# EAGLE design AQ_sensor_SIGFOX (EAGLE 9.6.2)
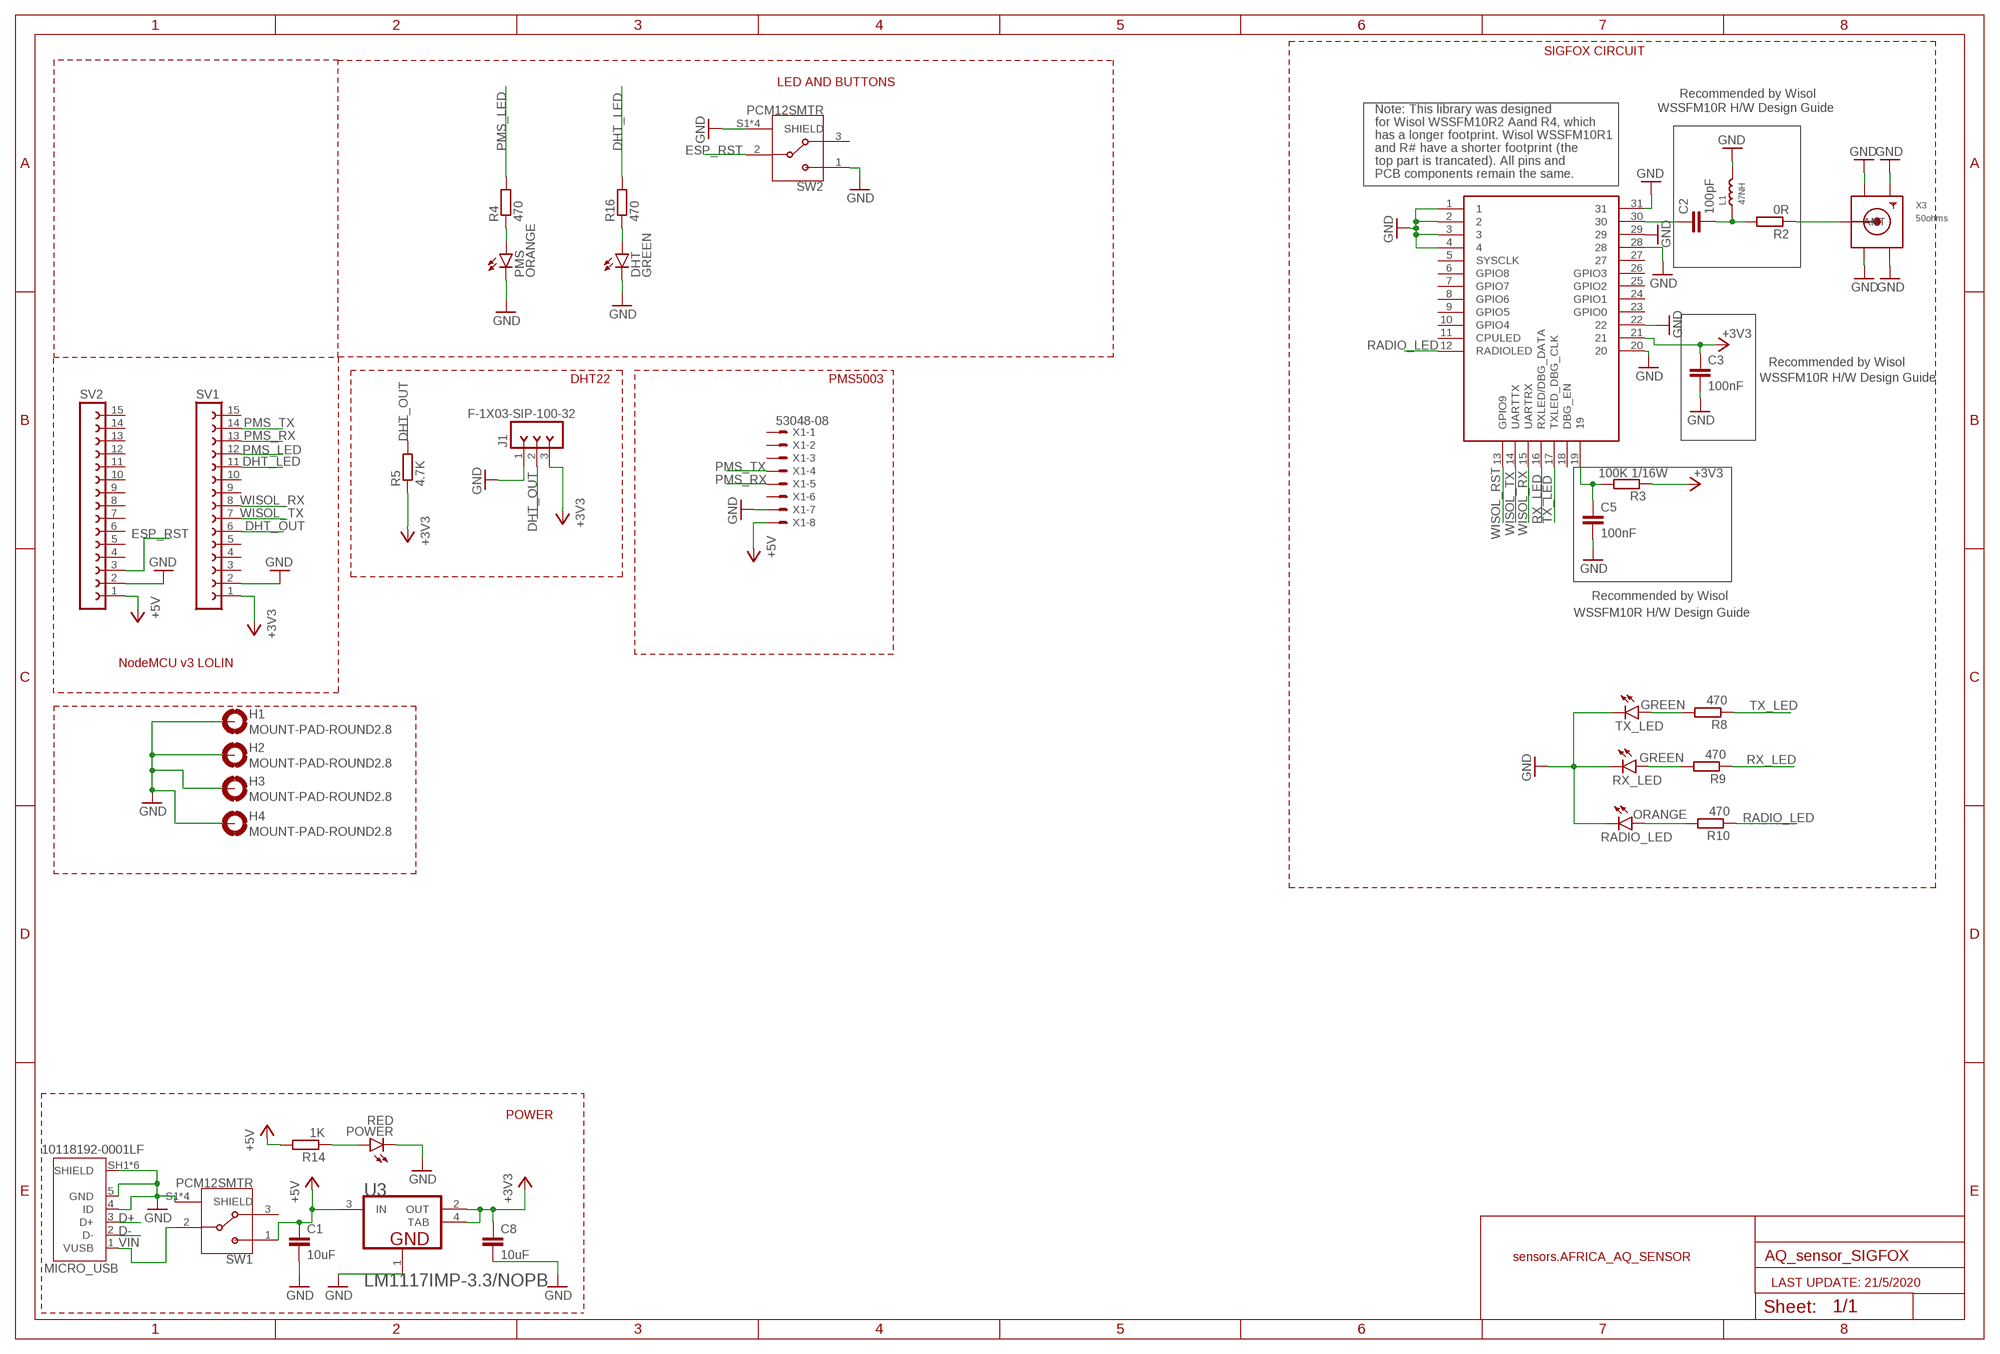
[diagram p0: schematic, sheet 1]

## Parts
C1  10uF  C-EUC0603  [C0603]
C2  100pF  C-EUC0603  [C0603]
C3  100nF  C-EUC0603  [C0603]
C5  100nF  C-EUC0603  [C0603]
C8  10uF  C-EUC0603  [C0603]
DHT  GREEN  LEDCHIP-LED0603  [CHIP-LED0603]
H1  MOUNT-PAD-ROUND2.8  [2,8-PAD]
H2  MOUNT-PAD-ROUND2.8  [2,8-PAD]
H3  MOUNT-PAD-ROUND2.8  [2,8-PAD]
H4  MOUNT-PAD-ROUND2.8  [2,8-PAD]
J1  F-1X03-SIP-100-32  [SIP-100-03-32]
L1  47NH  SMD-INDUCTOR-2.2UH-20%-1.2A(0805)  [L0805]
MICRO_USB  10118192-0001LF  [AMPHENOL_10118192-0001LF]
PMS  ORANGE  LEDCHIP-LED0603  [CHIP-LED0603]
POWER  RED  LEDCHIP-LED0603  [CHIP-LED0603]
R2  0R  R-EU_R0603  [R0603]
R3  100K 1/16W  R-EU_R0603  [R0603]
R4  470  R-EU_R0603  [R0603]
R5  4.7K  R-EU_R0603  [R0603]
R8  470  R-EU_R0603  [R0603]
R9  470  R-EU_R0603  [R0603]
R10  470  R-EU_R0603  [R0603]
R14  1K  R-EU_R0603  [R0603]
R16  470  R-EU_R0603  [R0603]
RADIO_LED  ORANGE  LEDCHIP-LED0603  [CHIP-LED0603]
RX_LED  GREEN  LEDCHIP-LED0603  [CHIP-LED0603]
SV1  FE15-1  [FE15]
SV2  FE15-1  [FE15]
SW1  PCM12SMTR  [SW_PCM12SMTR]
SW2  PCM12SMTR  [SW_PCM12SMTR]
TX_LED  GREEN  LEDCHIP-LED0603  [CHIP-LED0603]
U3  TEXAS_INSTRUMENTS_LM1117IMP-3.3-NOPBTEXAS_INSTRUMENTS_LM1117IMP-3.3-NOPB_0_0  [TEXAS_INSTRUMENTS_LM1117IMP-3.3-NOPB_0]
U$1  WSSFM10RWSSFM10R2R4  [WSSFM10R]
X1  53048-08  [53048-08]
X3  50ohms  SMACONNECTOR_EDGE_UFL  [SMA_EDGELAUNCH_UFL]

## Nets
+3V3 [POWER]: C3.1 C8.1 J1.3 R3.1 R5.1 SV1.1 U3.2(OUT) U3.4(TAB) U$1.21
+5V [POWER]: C1.1 R14.2 SV2.1 SW1.1 U3.3(IN) X1.8
D+: MICRO_USB.3(D+)
D-: MICRO_USB.2(D-)
DHT_LED: R16.2 SV1.11
DHT_OUT: J1.2 R5.2 SV1.6
ESP_RST: SV2.3 SW2.2
GND [BGA]: C1.2 C3.2 C5.2 C8.2 DHT.C H1.B2,8(MOUNT) H2.B2,8(MOUNT) H3.B2,8(MOUNT) H4.B2,8(MOUNT) J1.1 L1.2 MICRO_USB.4(ID) MICRO_USB.5(GND) MICRO_USB.SH1(SHIELD) MICRO_USB.SH2(SHIELD) MICRO_USB.SH3(SHIELD) MICRO_USB.SH4(SHIELD) MICRO_USB.SH5(SHIELD) MICRO_USB.SH6(SHIELD) PMS.C POWER.C RADIO_LED.C RX_LED.C SV1.2 SV2.2 SW1.S1(SHIELD) SW1.S2(SHIELD) SW1.S3(SHIELD) SW1.S4(SHIELD) SW2.1 SW2.S1(SHIELD) SW2.S2(SHIELD) SW2.S3(SHIELD) SW2.S4(SHIELD) TX_LED.C U3.1(GND) U$1.1 U$1.2 U$1.3 U$1.4 U$1.20 U$1.22 U$1.28 U$1.29 U$1.31 X1.7 X3.GND@1(GND1) X3.GND@2(GND2) X3.GND@3(GND3) X3.GND@4(GND4)
N$1: C2.1 U$1.30
N$2: C2.2 L1.1 R2.2
N$3: R2.1 X3.P(ANT)
N$4: PMS.A R4.1
N$5: C5.1 R3.2 U$1.19
N$7: R10.2 RADIO_LED.A
N$8: R9.2 RX_LED.A
N$15: R8.2 TX_LED.A
N$25: POWER.A R14.1
N$27: DHT.A R16.1
PMS_LED: R4.2 SV1.12
PMS_RX: SV1.13 X1.5
PMS_TX: SV1.14 X1.4
RADIO_LED: R10.1 U$1.12(RADIOLED)
RX_LED: R9.1 U$1.16(RXLED/DBG_DATA)
TX_LED: R8.1 U$1.17(TXLED_DBG_CLK)
VIN: MICRO_USB.1(VUSB) SW1.2
WISOL_RST: U$1.13(GPIO9)
WISOL_RX: SV1.8 U$1.15(UARTRX)
WISOL_TX: SV1.7 U$1.14(UARTTX)
Unconnected: SV1.3 SV1.4 SV1.5 SV1.9 SV1.10 SV1.15 SV2.4 SV2.5 SV2.6 SV2.7 SV2.8 SV2.9 SV2.10 SV2.11 SV2.12 SV2.13 SV2.14 SV2.15 SW1.3 SW2.3 U$1.5(SYSCLK) U$1.6(GPIO8) U$1.7(GPIO7) U$1.8(GPIO6) U$1.9(GPIO5) U$1.10(GPIO4) U$1.11(CPULED) U$1.18(DBG_EN) U$1.23(GPIO0) U$1.24(GPIO1) U$1.25(GPIO2) U$1.26(GPIO3) U$1.27 X1.1 X1.2 X1.3 X1.6

## Notes on the sheet
- SIGFOX CIRCUIT
- LED AND BUTTONS
- Recommended by Wisol
- Note: This library was designed | WSSFM10R H/W Design Guide
- for Wisol WSSFM10R2 Aand R4, which
- has a longer footprint. Wisol WSSFM10R1
- and R# have a shorter footprint (the
- top part is trancated). All pins and
- PCB components remain the same.
- Recommended by Wisol
- DHT22 | PMS5003 | WSSFM10R H/W Design Guide
- Recommended by Wisol
- WSSFM10R H/W Design Guide
- NodeMCU v3 LOLIN
- POWER
- sensors.AFRICA_AQ_SENSOR
- LAST UPDATE: 21/5/2020

## Library data of the parts
C1-C3 C5 C8 = rcl:C-EU: CAPACITOR, European symbol; SPICEPREFIX: C
DHT PMS POWER RADIO_LED RX_LED TX_LED = led:LED: LED OSRAM: - CHIPLED LG R971, LG N971, LY N971, LG Q971, LY Q971, LO R971, LY R971 LH N974, LH R974 LS Q976, LO Q976, LY Q976 LO Q996 - Hyper CHIPLED LW Q18S LB Q993, LB Q99A, LB R99A - SideLED LS A670, LO A670, LY A670, LG A670, LP A670 LB A673, LV A673, LT A673, LW A673 LH A674 LY A675 LS A676, LA A676, LO A676, LY A676, LW A676 LS A679, LY A679, LG A679 - Hyper Micro SIDELED® LS Y876, LA Y876, LO Y876, LY Y876 LT Y87S - SmartLED LW L88C, LW L88S LB L89C, LB L89S, LG L890 LS L89K, LO L89K, LY L89K LS L896, LA L896, LO L896, LY L896 - TOPLED LS T670, LO T670, LY T670, LG T670, LP T670 LSG T670, LSP T670, LSY T670, LOP T670, LYG T670 LG T671, LOG T671, LSG T671 LB T673, LV T673, LT T673, LW T673 LH T674 LS T676, LA T676, LO T676, LY T676, LB T676, LH T676, LSB T676, LW T676 LB T67C, LV T67C, LT T67C, LS T67K, LO T67K, LY T67K, LW E67C LS E67B, LA E67B, LO E67B, LY E67B, LB E67C, LV E67C, LT E67C LW T67C LS T679, LY T679, LG T679 LS T770, LO T770, LY T770, LG T770, LP T770 LB T773, LV T773, LT T773, LW T773 LH T774 LS E675, LA E675, LY E675, LS T675 LS T776, LA T776, LO T776, LY T776, LB T776 LHGB T686 LT T68C, LB T68C - Hyper Mini TOPLED® LB M676 - Mini TOPLED Santana® LG M470 LS M47K, LO M47K, LY M47K Source: http://www.osram.convergy.de LUXEON: - LUMILED® LXK2-PW12-R00, LXK2-PW12-S00, LXK2-PW14-U00, LXK2-PW14-V00 LXK2-PM12-R00, LXK2-PM12-S00, LXK2-PM14-U00 LXK2-PE12-Q00, LXK2-PE12-R00, LXK2-PE12-S00, LXK2-PE14-T00, LXK2-PE14-U00 LXK2-PB12-K00, LXK2-PB12-L00, LXK2-PB12-M00, LXK2-PB14-N00, LXK2-PB14-P00, LXK2-PB14-Q00 LXK2-PR12-L00, LXK2-PR12-M00, LXK2-PR14-Q00, LXK2-PR14-R00 LXK2-PD12-Q00, LXK2-PD12-R00, LXK2-PD12-S00 LXK2-PH12-R00, LXK2-PH12-S00 LXK2-PL12-P00, LXK2-PL12-Q00, LXK2-PL12-R00 Source: www.luxeon.com KINGBRIGHT: KA-3528ASYC Source: www.kingbright.com
H1-H4 = AQ_sensor_GSM:MOUNT-PAD-ROUND: MOUNTING PAD, round
J1 = AQ_sensor_GSM:F-1X03-: FEMALE HEADER
L1 = OPL_Inductor:SMD-INDUCTOR-2.2UH-20%-1.2A(0805): 303010086; MPN: LQM2MPN2R2MG0; VALUE: 2.2UH-1.2A
MICRO_USB = AQ_sensor_GSM:10118192-0001LF: Single Port 5 Contact Horizontal Right Angle Shielded Micro B USB 2.0 Connector; AVAILABILITY: Unavailable; DESCRIPTION: USB - micro B USB 2.0 Receptacle Connector 5 Position Surface Mount, Right Angle; MF: Amphenol ICC; MP: 10118192-0001LF; PACKAGE: None; PRICE: None
R2-R5 R8-R10 R14 R16 = rcl:R-EU_: RESISTOR, European symbol; SPICEPREFIX: R
SV1 SV2 = AQ_sensor_GSM:FE15-1: FEMALE HEADER; OC_FARNELL: unknown; OC_NEWARK: unknown
SW1 SW2 = AQ_sensor_GSM:PCM12SMTR: Switch Slide ON ON SPDT Side Slide 0.3A 6VDC 10000Cycles Gull Wing SMD T/R; AVAILABILITY: Unavailable; DESCRIPTION: Slide Switch SPDT Surface Mount, Right Angle; MF: C&K; MP: PCM12SMTR; PACKAGE: DO-201 C&amp;K Components; PRICE: None
U3 = AQ_sensor_GSM:TEXAS_INSTRUMENTS_LM1117IMP-3.3-NOPB: PM-REG-LM1086-SOT4; CIIVA_IDS: 19361124; CODE__IPC: SOT223-4; CODE__JEDEC: TO-261-AA; COMPONENT_LINK_1_DESCRIPTION: Datasheet URL; COMPONENT_LINK_1_URL: http://www.ti.com/general/docs/lit/getliterature.tsp?genericPartNumber=LM1117-N&fileType=pdf; COMP_TYPE: LDO IC; FOOTPRINT_VARIANT_NAME_0: Level C; FOOTPRINT_VARIANT_NAME_1: Level B; FOOTPRINT_VARIANT_NAME_2: Level A; HIGH__RELIABILITY: Y; IMPORTED: yes; IMPORTED_FROM: vault; IMPORT_TS: 1521845365; MF: Texas Instruments; MPN: LM1117IMP-3.3/NOPB; PACKAGE: DCY0004A; PACKAGE_DESCRIPTION: Molded SOT-223, 6.50 x 3.56 x 1.6mm Body, 4 Lead, 2.3mm Pitch; PACKAGE_TOP_MARKING: XYTT*N05B; PIN_COUNT: 4; POWER_WISE: N; PREFIX: U; RELEASE_DATE: 1464077430; ROHS: Yes; VAULT_GUID: 7E820BF6-F141-44C1-8A74-392CB201F257; VAULT_REVISION: 16019014-2FBF-4157-ADF5-B132B4DC413A
U$1 = WisolWSSFM10R:WSSFM10R
X1 = AQ_sensor_GSM:53?-08: CONNECTOR wire to board 1.25 mm (.049 inch) pitch header; MF: WALDOM/MOLEX; MPN: 53048-0810; OC_FARNELL: 9733094; OC_NEWARK: 38C9913
X3 = AQ_sensor_GSM:SMACONNECTOR: SMA Connector 90° DIP SMA Connector, 50 Ohm (4UConnector: 07259)

## Net classes
0 default: width 0.3 mm, drill 0.3 mm, clearance 0.2 mm
1 POWER: width 0.4 mm, drill 0.3 mm, clearance 0.2 mm to class 0, clearance 0.2 mm

## Board
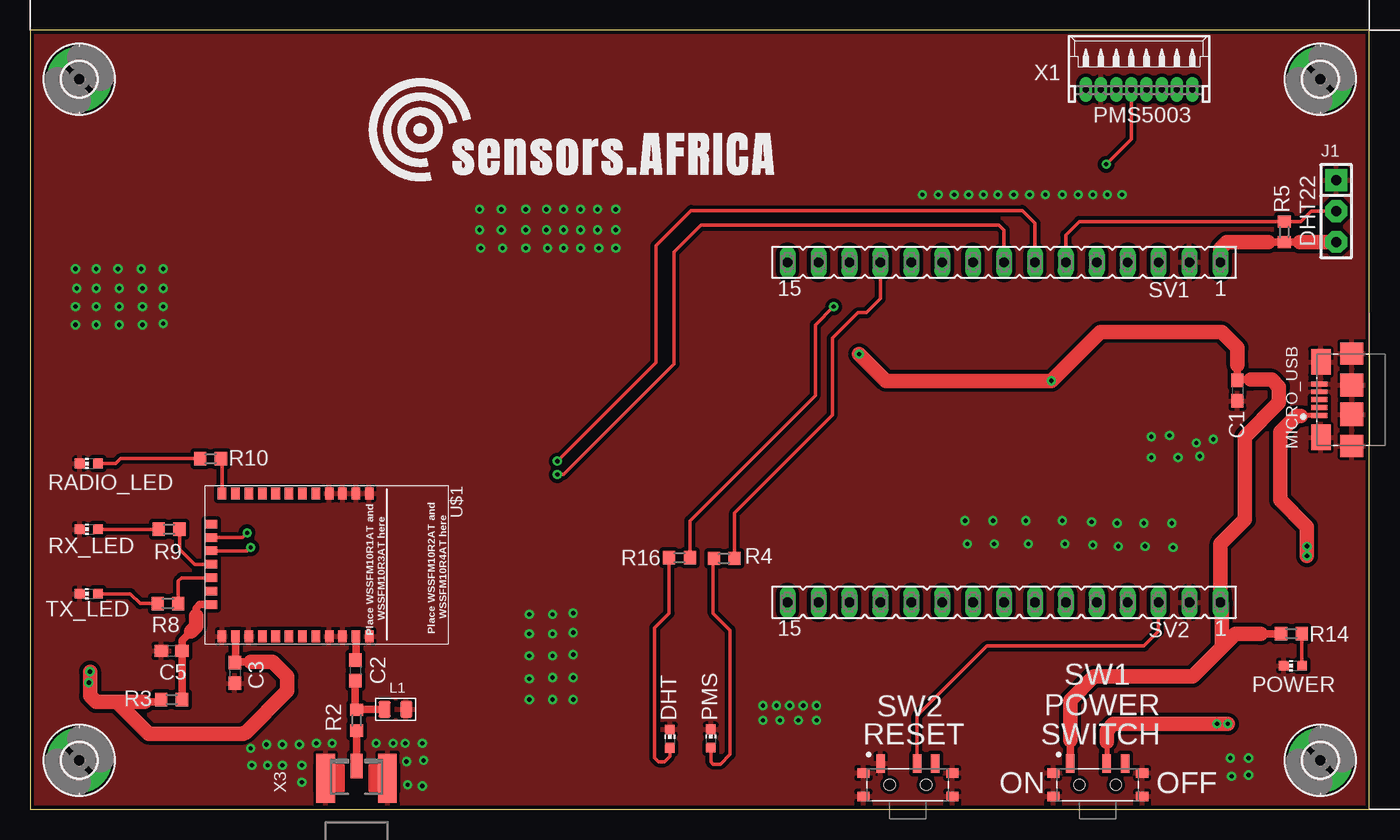
[diagram p1: board, top side]
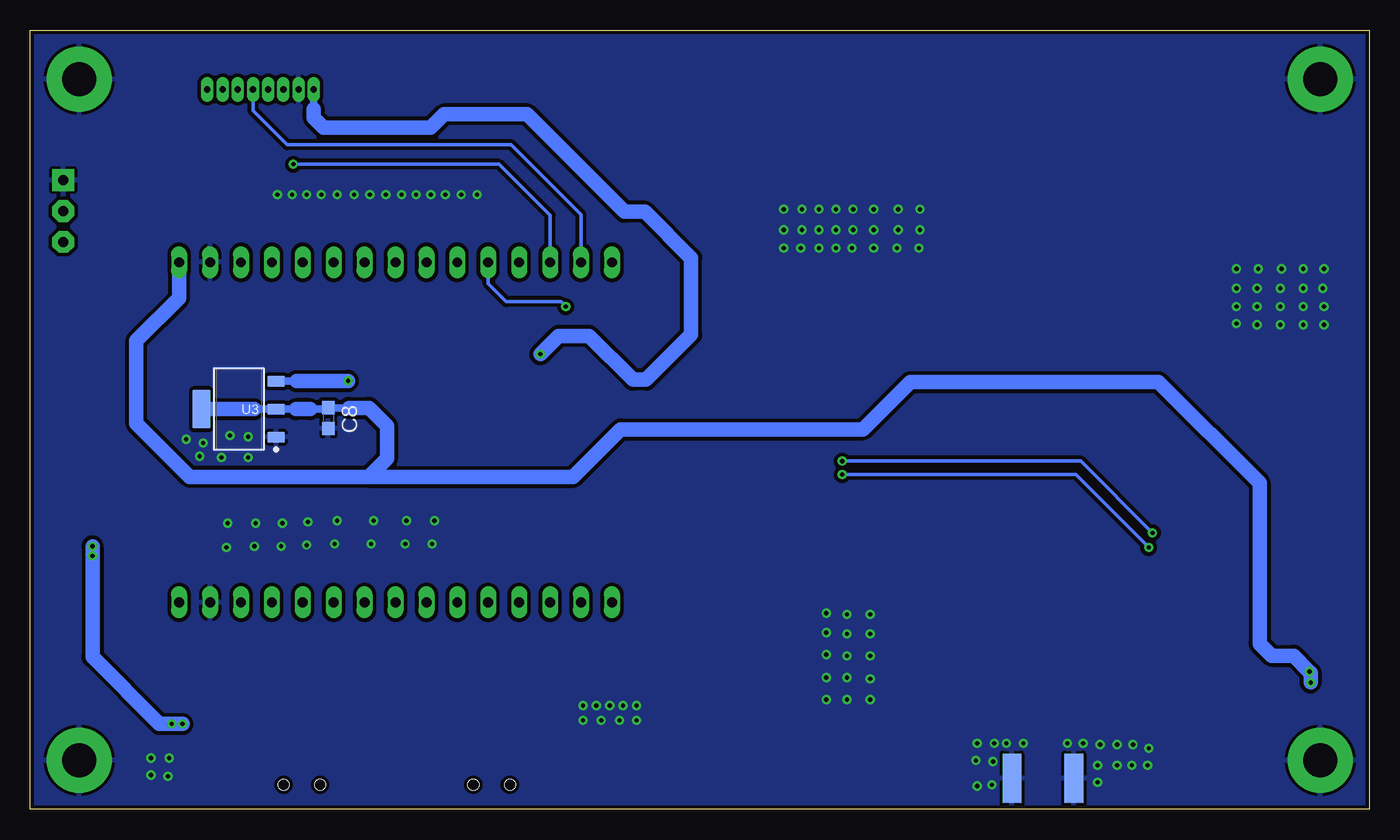
[diagram p2: board, bottom side, seen from below]

Size 110 x 64 mm. Coordinates in mm from the lower left corner, seen from the top.
Outline: 0,0 110,0 110,64 0,64 0,0
Copper layers (1*16): Top 0.035mm / dielectric 1.5mm / Bottom 0.035mm
Design rules "default *": minimum track width 0.1mm, minimum drill 0.15mm, track to track 0.3mm, track to pad 0.1mm, pad to pad 0.2mm, via to via 0.3mm, smd to smd 0.3mm, copper to edge 0.3mm, drill to drill 0.3mm, minimum pad ring 10mil, minimum via ring 8mil, stop-mask expansion 4mil, vias tented up to drill 0mil, thermal gap 10mil

### Footprints (pad centres in the part's own frame; a part is rotated, then mirrored left to right if it is on the bottom)
C0603 = smd 1.1 x 1: 1 -0.85,0; 2 0.85,0
CHIP-LED0603 = smd 0.8 x 0.8: A 0,-0.75; C 0,0.75
2,8-PAD = drill 2.8 pad 5.334: B2,8 0,0
SIP-100-03-32 = drill 0.813 pad 1.778 square: 1 -2.54,0 | drill 0.813 pad 1.778 octagon: 2 0,0; 3 2.54,0
L0805 = smd 1.016 x 1.397: 1 -0.889,0; 2 0.889,0
AMPHENOL_10118192-0001LF = smd 0.4 x 1.35: 1 -1.3,0; 2 -0.65,0; 3 0,0; 4 0.65,0; 5 1.3,0 | smd 2.1 x 1.6: SH1 -3.1,-0.125; SH2 3.1,-0.125 | smd 1.8 x 1.9: SH3 -3.8,-2.675; SH6 3.8,-2.675 | smd 1.9 x 1.9: SH4 -1.2,-2.675; SH5 1.2,-2.675
R0603 = smd 1 x 1.1: 1 -0.85,0; 2 0.85,0
FE15 = drill 0.813 long: 1 -17.78,0; 2 -15.24,0; 3 -12.7,0; 4 -10.16,0; 5 -7.62,0; 6 -5.08,0; 7 -2.54,0; 8 0,0; 9 2.54,0; 10 5.08,0; 11 7.62,0; 12 10.16,0; 13 12.7,0; 14 15.24,0; 15 17.78,0
SW_PCM12SMTR = smd 0.7 x 1.5: 1 -2.25,1.75; 2 0.75,1.75; 3 2.25,1.75 | smd 1 x 0.8: S1 -3.65,0.965; S2 -3.65,-0.965; S3 3.65,-0.965; S4 3.65,0.965 | hole 0.9: -1.5,0; 1.5,0
TEXAS_INSTRUMENTS_LM1117IMP-3.3-NOPB_0 = smd 1.45 x 0.9: 1 -3.075,2.3; 2 -3.075,0; 3 -3.075,-2.3 | smd 1.45 x 3.15: 4 3.075,0
WSSFM10R = smd 1 x 0.7: 1 0.65,13.55; 2 0.65,12.45; 3 0.65,11.35; 4 0.65,10.25; 5 0.65,9.15; 6 0.65,8.05; 7 0.65,6.95; 8 0.65,5.85; 9 0.65,4.75; 10 0.65,3.65; 11 0.65,2.55; 12 0.65,1.45; 20 12.4,1.45; 21 12.4,2.55; 22 12.4,3.65; 23 12.4,4.75; 24 12.4,5.85; 25 12.4,6.95; 26 12.4,8.05; 27 12.4,9.15; 28 12.4,10.25; 29 12.4,11.35; 30 12.4,12.45; 31 12.4,13.55 | smd 0.7 x 1: 13 3.18,0.56; 14 4.28,0.56; 15 5.38,0.56; 16 6.48,0.56; 17 7.58,0.56; 18 8.68,0.56; 19 9.78,0.56
53048-08 = drill 0.5 pad 0.698 long: 1 4.375,-1.25; 2 3.125,-1.25; 3 1.875,-1.25; 4 0.625,-1.25; 5 -0.625,-1.25; 6 -1.875,-1.25; 7 -3.125,-1.25; 8 -4.375,-1.25
SMA_EDGELAUNCH_UFL = smd 4.064 x 1.524: GND@1 2.032,-2.54; GND@2 2.032,2.54 | smd 4.064 x 1.524 bottom: GND@3 2.032,2.54; GND@4 2.032,-2.54 | smd 2.032 x 1.016: P 3.048,0

### Placement (x,y rotation side)
C1  99.18,34.4 270 top
C2  26.7,11.4 270 top
C3  16.8,11.2 270 top
C5  11.6,13 180 top
C8  85.52,32.13 270 bottom
DHT  52.54,5.79 0 top
H1  106,4 0 top
H2  106,60 0 top
H3  4,60 0 top
H4  4,4 0 top
J1  107.3,49.15 270 top
L1  30,8.2 0 top
MICRO_USB  105.91,33.65 90 top
PMS  55.91,5.8 0 top
POWER  103.74,11.79 90 top
R2  26.8,7.3 90 top
R3  11.6,9 0 top
R4  57.01,20.6 0 top
R5  103.03,47.44 90 top
R8  11.3,16.9 180 top
R9  11.4,23 180 top
R10  14.8,28.8 180 top
R14  103.61,14.43 180 top
R16  53.34,20.66 0 top
RADIO_LED  4.8,28.4 90 top
RX_LED  4.8,23 90 top
SV1  80,44.94 180 top
SV2  80,17 180 top
SW1  87.7,2 0 top
SW2  72.1,2 0 top
TX_LED  4.8,17.7 90 top
U3  92.88,32.87 180 bottom
U$1  14.3,26.6 270 top
X1  91.09,60.4 0 top
X3  26.8,0.5 90 top

### Tracks (layer width: path | path; a pad name or v marks a point on that pad's centre or on a via)
+3V3  (via drill 0.35)
  Top 0.6: U$1.21 16.85,12.1 | 16.85,12.1 C3.1 | R3.1 10.55,8.8 9.4,8.8 | 101.7,46.6 R5.1 104.29,46.59 | 18.1,12.1 16.85,12.1
  Top 1.2: v4.9,11.3 4.9,9.3 5.4,8.8 7.1,8.8 | 7.1,8.8 9.7,6.2 17.49,6.2 17.57,6.28 17.68,6.28 21.1,9.7 21.1,10.9 19.9,12.1 18.1,12.1 | SV1.1 97.78,46.08 98.3,46.6 101.7,46.6 | 104.29,46.59 107.28,46.59 J1.3 | 7.1,8.8 9.4,8.8
  Bottom 0.6: 91.63,32.87 U3.2 88.17,32.87 | 87.03,32.87 85.63,32.87 C8.1 83.82,32.98
  Bottom 1.2: U3.4 91.63,32.87 | 83.82,32.98 82.18,32.98 80.7,31.5 80.7,28.8 82.2,27.3 | SV1.1 97.78,42.02 101.3,38.5 101.3,31.7 96.9,27.3 82.2,27.3 | 82.2,27.3 65.4,27.3 61.5,31.2 41.6,31.2 37.7,35.1 17.3,35.1 9,26.8 9,13.6 8,12.6 6.2,12.6 v4.9,11.3 4.8,11.2 v4.8,10.4 | 87.03,32.87 88.17,32.87
+5V  (via drill 0.35)
  Top 0.6: SW1.1 85.45,5.65 | R14.2 102.73,14.4 101.1,14.4 | 100.3,35.3 99.23,35.3 C1.1 99.18,36.48
  Top 1.2: 85.45,5.65 85.45,8.95 87.4,10.9 95.5,10.9 97.9,13.3 | 97.9,13.3 97.9,16.88 SV2.1 97.78,21.78 99.8,23.8 99.8,30.6 102.6,33.4 102.6,34.7 102,35.3 100.3,35.3 | 101.1,14.4 99,14.4 97.9,13.3 | v68.1,37.4 70.3,35.2 v83.9,35.2 87.9,39.2 97.9,39.2 99.18,37.92 99.18,36.48
  Bottom 0.6: U3.3 88.13,35.17 | X1.8 86.72,57.52
  Bottom 1.2: 88.13,35.17 83.93,35.17 v83.9,35.2 | v68.1,37.4 66.6,38.9 64.1,38.9 60.5,35.3 59.4,35.3 55.7,39 55.7,45.3 59.5,49.1 61.2,49.1 69.2,57.1 76,57.1 77.1,56 85.9,56 86.72,56.81 86.72,57.52
DHT_LED  (via drill 0.35)
  Top 0.3: R16.2 54.19,23.69 64.5,34 64.5,39.8 v66,41.3
  Bottom 0.3: v66,41.3 66.4,41.7 70.9,41.7 72.38,43.18 SV1.11
DHT_OUT
  Top 0.3: SV1.6 85.08,47.18 86.19,48.29 R5.2 104.39,48.29 105.25,49.15 J1.2
ESP_RST
  Top 0.3: SW2.2 72.85,7.65 78.6,13.4 91.5,13.4 92.7,14.6 SV2.3
GND  (via drill 0.35)
  other vias: 76.8,23.7 79.1,23.7 81.8,23.7 84.8,23.7 87.2,23.6 89.3,23.5 91.5,23.5 93.8,23.5 93.9,21.5 91.6,21.6 89.4,21.6 87.3,21.7 85,21.8 82,21.8 79.2,21.8 77,21.8 92.1,30.6 93.6,30.7 95.8,30.1 97.2,30.4 92.1,28.9 94.3,28.9 96.1,29 100.1,4.2 98.6,4.2 98.7,2.7 100.1,2.8 60.2,8.5 61.3,8.5 62.4,8.5 63.5,8.5 64.6,8.5 60.2,7.3 61.6,7.3 63.1,7.3 64.6,7.3 36.9,49.3 38.7,49.3 40.7,49.3 42.4,49.3 43.8,49.3 45.2,49.3 46.6,49.3 48.1,49.3 36.9,47.6 38.7,47.6 40.7,47.6 42.4,47.6 43.8,47.6 45.2,47.6 46.6,47.6 48.1,47.6 37,46.1 38.8,46.1 40.7,46.1 42.5,46.1 43.8,46.1 45.2,46.1 46.7,46.1 48.1,46.1 74.6,50.5 75.9,50.5 77.1,50.5 78.3,50.5 79.5,50.5 80.8,50.5 82.1,50.5 73.3,50.5 89.7,50.5 88.5,50.5 87.3,50.5 86.1,50.5 84.8,50.5 83.4,50.5 3.7,39.8 5.4,39.8 7.3,39.8 9.2,39.8 10.9,39.9 10.9,41.3 9.2,41.3 7.3,41.3 5.4,41.3 3.7,41.3 10.9,42.8 9.2,42.8 7.3,42.8 5.4,42.8 3.8,42.8 7.2,44.4 9.1,44.4 10.9,44.4 5.4,44.4 3.7,44.4 18.1,5 19.4,5.3 20.7,5.3 22.1,5.3 18.2,3.6 19.5,3.6 20.7,3.6 22.3,3.6 22.3,2.2 30.8,5.4 32.2,5.4 30.9,3.9 32.3,4 31,2 32.2,1.9 23.5,5.4 24.8,5.4 28.4,5.4 29.8,5.4 41,16 42.9,16 44.6,16.1 41,14.4 42.9,14.4 44.6,14.5 41,12.6 42.9,12.6 44.6,12.7 41,10.7 42.9,10.8 44.6,10.8 41,9 42.9,9 44.6,9
  pour Top: 0,0 110,0 110,64 0,64
  pour Bottom: 0,0 109.9,0 110,64 0,64
N$1
  Top 0.6: U$1.30 26.75,12.3 C2.1
N$2
  Top 0.6: C2.2 26.7,8.25 R2.2 26.85,8.2 L1.1
N$3
  Top 0.6: R2.1 X3.P
N$4
  Top 0.3: R4.1 56.1,20.54 56.1,16.1 57.5,14.7 57.5,4.5 56.7,3.7 56.1,3.7 55.91,3.89 PMS.A
N$5
  Top 0.6: U$1.19 13.92,16.82 13.6,16.5 13.6,15.9 | 13.2,14.6 12.45,13.85 C5.1 R3.2
  Top 1.2: 13.6,15.9 13.6,15 13.2,14.6
N$7
  Top 0.3: R10.2 7.4,28.8 7,28.4 RADIO_LED.A
N$8
  Top 0.3: R9.2 RX_LED.A
N$15
  Top 0.3: R8.2 9,16.9 8.2,17.7 TX_LED.A
N$25
  Top 0.3: R14.1 104.46,11.82
  Top 0.4: 104.46,11.82 POWER.A
N$27
  Top 0.3: R16.1 52.49,16.09 51.3,14.9 51.3,4.2 51.6,3.9 52.1,3.9 52.54,4.34 DHT.A
PMS_LED
  Top 0.3: R4.2 57.86,24.36 65.9,32.4 65.9,38.7 68,40.8 68.7,40.8 69.84,41.94 SV1.12
PMS_RX  (via drill 0.35)
  Top 0.3: v88.4,53 90.47,55.06 X1.5
  Bottom 0.3: SV1.13 67.3,48.8 71.5,53 v88.4,53
PMS_TX
  Bottom 0.3: SV1.14 64.76,48.86 70.5,54.6 88.9,54.6 91.72,57.41 X1.4
RADIO_LED
  Top 0.3: U$1.12 15.75,28.7 R10.1
RX_LED
  Top 0.3: U$1.16 13.48,20.12 12.25,21.35 R9.1
TX_LED
  Top 0.3: U$1.17 12.42,19.02 12.15,18.75 R8.1
VIN  (via drill 0.35)
  Top 0.4: 88.45,5.55 SW1.2 | MICRO_USB.1 104.45,32.35 104.4,32.3
  Top 1.2: v104.9,20.8 v104.9,21.6 104.9,23.2 102.7,25.4 102.7,31 104,32.3 104.4,32.3 | 88.45,5.55 88.45,6.45 89,7 v98.4,7
  Bottom 1.2: v97.5,7 v98.4,7 99.4,7 104.9,12.5 v104.9,21.6
WISOL_RX  (via drill 0.35)
  Top 0.3: U$1.15 17.82,21.22 v18.1,21.5 | v43.3,27.5 43.8,27.5 52.9,36.6 52.9,45.8 55.1,48 79.6,48 80,47.6 SV1.8
  Bottom 0.3: v18.1,21.5 24.1,27.5 v43.3,27.5
WISOL_TX  (via drill 0.35)
  Top 0.3: U$1.14 17.42,22.32 v17.8,22.7 | v43.3,28.6 51.4,36.7 51.4,46.3 54.3,49.2 81.5,49.2 82.54,48.16 SV1.7
  Bottom 0.3: v17.8,22.7 23.7,28.6 v43.3,28.6

### Text on the board
tPlace: POWER | RESET | SWITCH | /Users/kirah/Downloads/Logo-Files-01.bmp
tNames: PMS5003 | DHT22 | ON | OFF